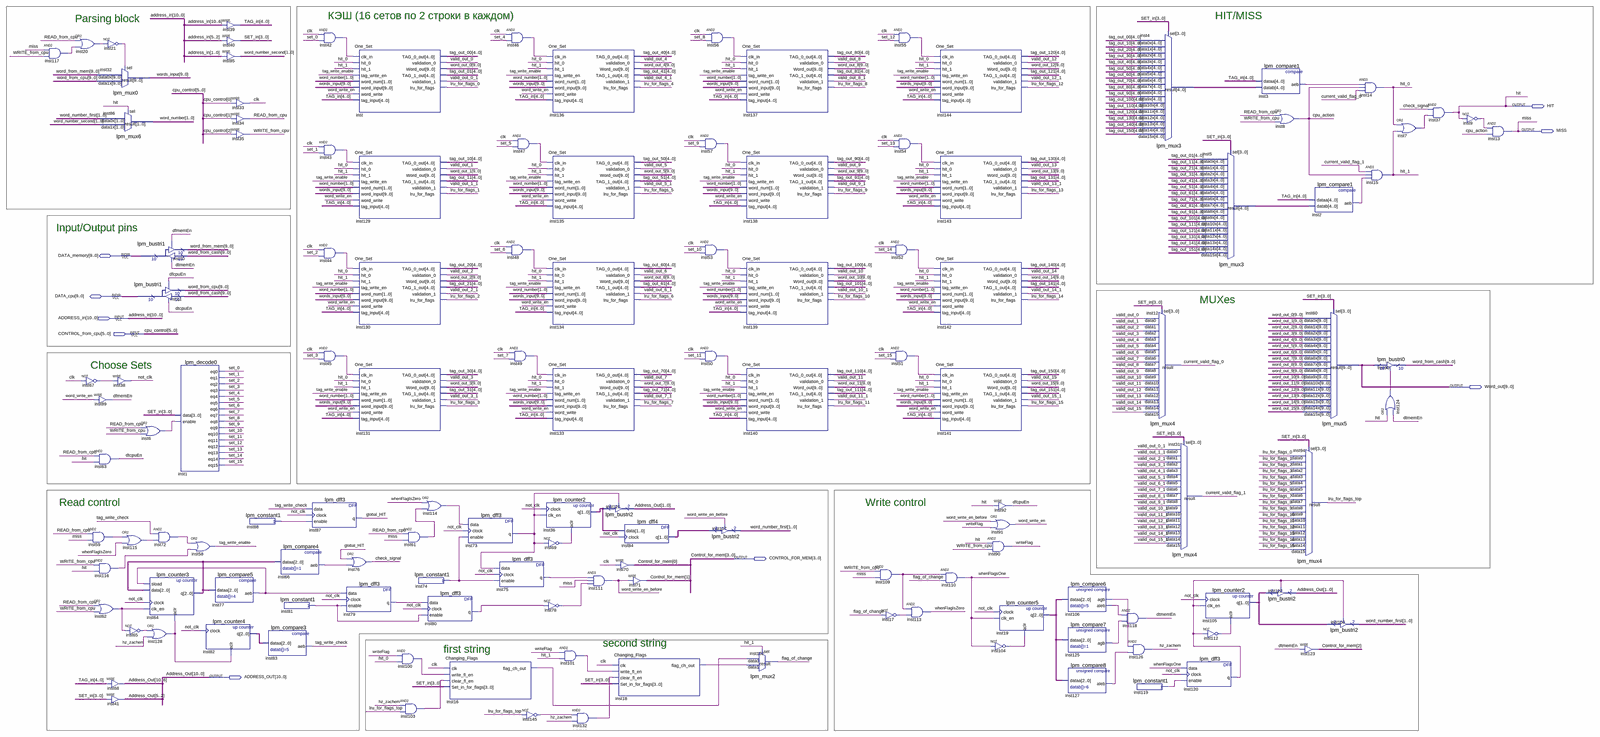
[diagram p0: schematic sheet, whole]
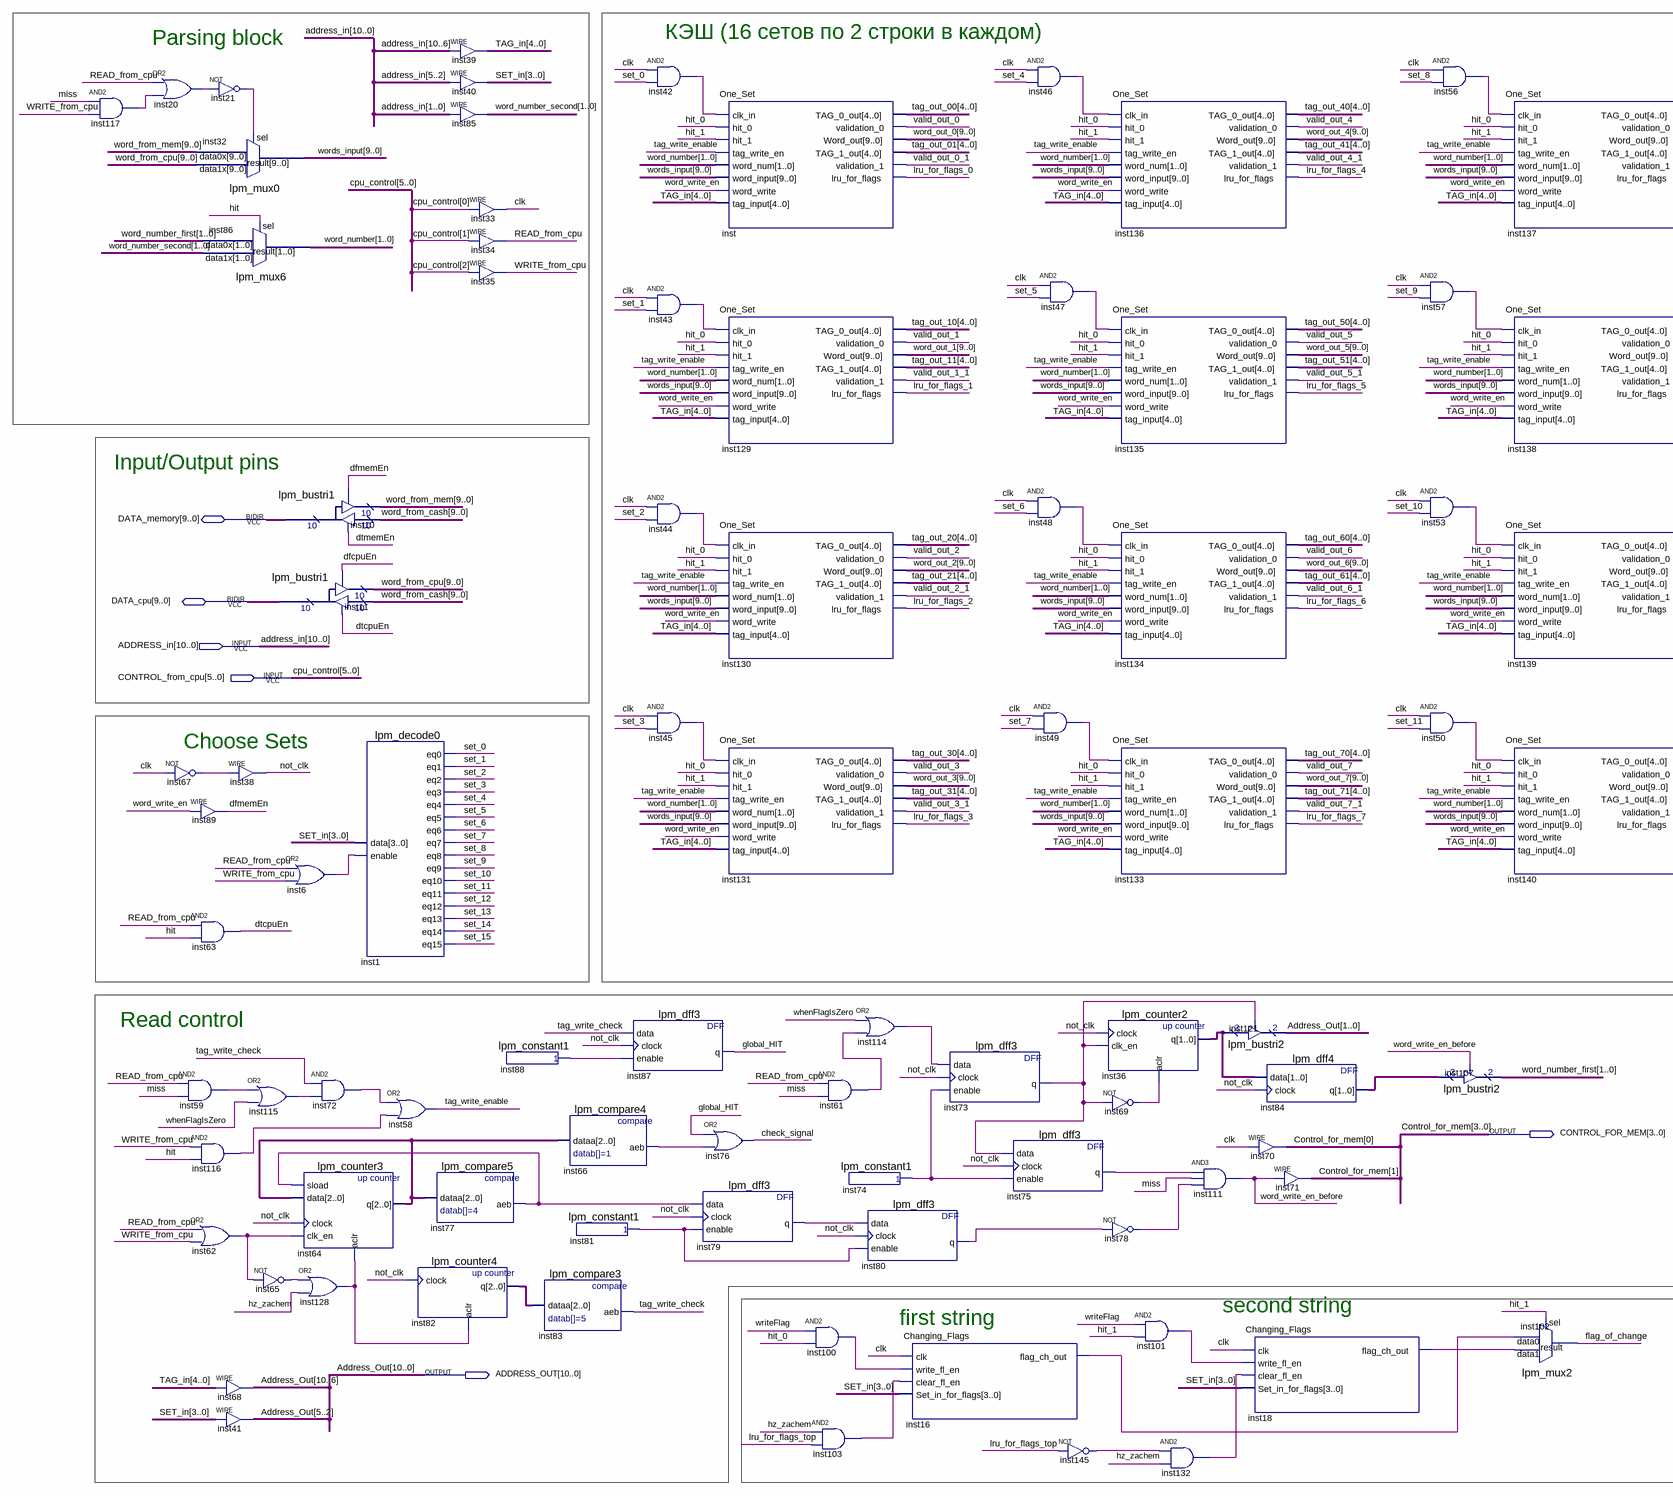
[diagram p1: schematic sheet, left part]
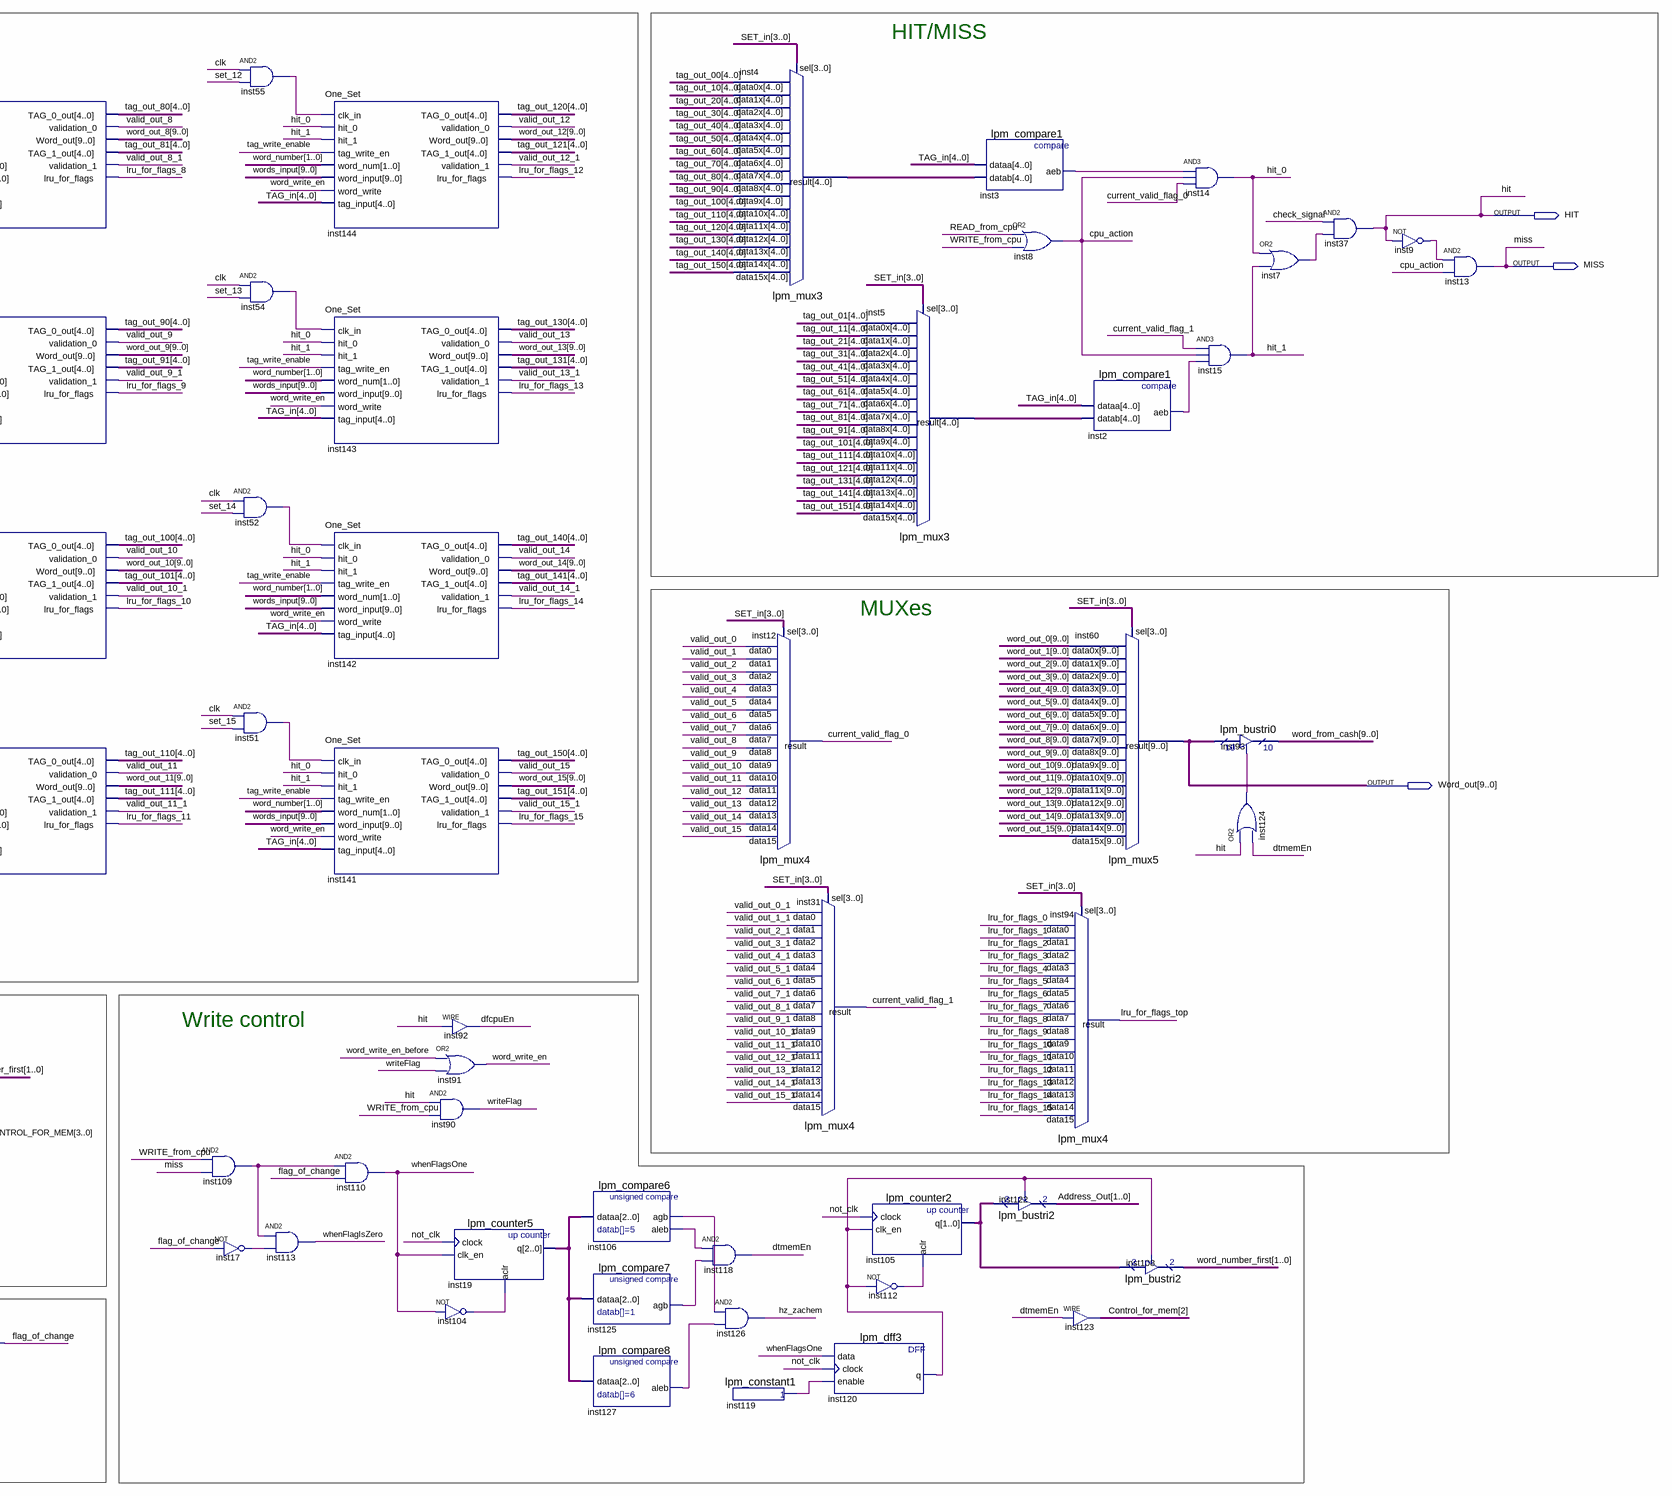
[diagram p2: schematic sheet, right part]
// Quartus schematic Cash.bdf as structural Verilog: 132 symbols, 9 pins
module Cash (
  input  [10:0] ADDRESS_in,
  input  [5:0] CONTROL_from_cpu,
  inout  [9:0] DATA_memory,
  inout  [9:0] DATA_cpu,
  output HIT,
  output MISS,
  output [9:0] Word_out,
  output [3:0] CONTROL_FOR_MEM,
  output [10:0] ADDRESS_OUT
);

  wire check_signal, clk, cpu_action, current_valid_flag_0, current_valid_flag_1, dfcpuEn, dfmemEn, dtcpuEn,
       dtmemEn, flag_of_change, global_HIT, hit_0, hit_1, hz_zachem, inst2_aeb, inst3_aeb, inst6_out,
       inst7_out, inst9_out, inst16_flag_ch_out, inst17_out, inst18_flag_ch_out, inst20_out, inst21_out,
       inst42_out, inst43_out, inst44_out, inst45_out, inst46_out, inst47_out, inst48_out, inst49_out,
       inst50_out, inst51_out, inst52_out, inst53_out, inst54_out, inst55_out, inst56_out, inst57_out,
       inst59_out, inst61_out, inst62_out, inst65_out, inst66_aeb, inst67_out, inst69_out, inst72_out,
       inst73_q, inst74_result, inst75_q, inst77_aeb, inst78_out, inst79_q, inst80_q, inst81_result,
       inst88_result, inst100_out, inst101_out, inst103_out, inst104_out, inst106_agb, inst106_aleb,
       inst109_out, inst112_out, inst114_out, inst115_out, inst116_out, inst117_out, inst119_result,
       inst120_q, inst124_out, inst125_agb, inst127_aleb, inst128_out, inst132_out, inst145_out,
       lru_for_flags_0, lru_for_flags_1, lru_for_flags_2, lru_for_flags_3, lru_for_flags_4, lru_for_flags_5,
       lru_for_flags_6, lru_for_flags_7, lru_for_flags_8, lru_for_flags_9, lru_for_flags_10,
       lru_for_flags_11, lru_for_flags_12, lru_for_flags_13, lru_for_flags_14, lru_for_flags_15,
       lru_for_flags_top, not_clk, READ_from_cpu, set_0, set_1, set_2, set_3, set_4, set_5, set_6, set_7,
       set_8, set_9, set_10, set_11, set_12, set_13, set_14, set_15, tag_write_check, tag_write_enable,
       valid_out_0, valid_out_0_1, valid_out_1, valid_out_1_1, valid_out_2, valid_out_2_1, valid_out_3,
       valid_out_3_1, valid_out_4, valid_out_4_1, valid_out_5, valid_out_5_1, valid_out_6, valid_out_6_1,
       valid_out_7, valid_out_7_1, valid_out_8, valid_out_8_1, valid_out_9, valid_out_9_1, valid_out_10,
       valid_out_10_1, valid_out_11, valid_out_11_1, valid_out_12, valid_out_12_1, valid_out_13,
       valid_out_13_1, valid_out_14, valid_out_14_1, valid_out_15, valid_out_15_1, whenFlagIsZero,
       whenFlagsOne, word_write_en, word_write_en_before, WRITE_from_cpu, writeFlag;
  wire [1:0] inst36_q, inst84_q, inst105_q, word_number, word_number_first, word_number_second;
  wire [2:0] inst19_q, inst64_q, inst82_q;
  wire [3:0] SET_in;
  wire [4:0] inst4_result, inst5_result, TAG_in, tag_out_00, tag_out_01, tag_out_10, tag_out_11, tag_out_20,
       tag_out_21, tag_out_30, tag_out_31, tag_out_40, tag_out_41, tag_out_50, tag_out_51, tag_out_60,
       tag_out_61, tag_out_70, tag_out_71, tag_out_80, tag_out_81, tag_out_90, tag_out_91, tag_out_100,
       tag_out_101, tag_out_110, tag_out_111, tag_out_120, tag_out_121, tag_out_130, tag_out_131,
       tag_out_140, tag_out_141, tag_out_150, tag_out_151;
  wire [9:0] word_from_cash, word_from_cpu, word_from_mem, word_out_0, word_out_1, word_out_2, word_out_3,
       word_out_4, word_out_5, word_out_6, word_out_7, word_out_8, word_out_9, word_out_10, word_out_11,
       word_out_12, word_out_13, word_out_14, word_out_15, words_input;

  and inst117 (inst117_out, MISS, WRITE_from_cpu);
  or inst20 (inst20_out, READ_from_cpu, inst117_out);
  not inst67 (inst67_out, clk);
  assign dfmemEn = word_write_en;  // WIRE inst89
  and inst63 (dtcpuEn, READ_from_cpu, HIT);
  and inst59 (inst59_out, READ_from_cpu, MISS);
  and inst116 (inst116_out, WRITE_from_cpu, HIT);
  or inst62 (inst62_out, READ_from_cpu, WRITE_from_cpu);
  not inst21 (inst21_out, inst20_out);
  lpm_mux0 inst32 (.data1x(word_from_cpu), .data0x(word_from_mem), .sel(inst21_out), .result(words_input));
  lpm_mux6 inst86 (.data1x(word_number_second), .data0x(word_number_first), .sel(HIT), .result(word_number));
  assign not_clk = inst67_out;  // WIRE inst38
  assign ADDRESS_OUT[10:6] = TAG_in;  // WIRE inst68
  assign ADDRESS_OUT[5:2] = SET_in;  // WIRE inst41
  lpm_bustri1 inst10 (
    .enabledt(dtmemEn), .data(word_from_cash), .enabletr(dfmemEn), .result(word_from_mem),
    .tridata(DATA_memory));
  lpm_bustri1 inst11 (
    .enabledt(dtcpuEn), .data(word_from_cash), .enabletr(dfcpuEn), .result(word_from_cpu), .tridata(DATA_cpu));
  or inst6 (inst6_out, READ_from_cpu, WRITE_from_cpu);
  or inst115 (inst115_out, inst59_out, whenFlagIsZero);
  lpm_counter3 inst64 (
    .sload(inst77_aeb), .data(inst64_q), .clock(not_clk), .clk_en(inst62_out), .aclr(inst128_out),
    .q(inst64_q));
  not inst65 (inst65_out, inst62_out);
  and inst72 (inst72_out, tag_write_check, inst115_out);
  or inst128 (inst128_out, inst65_out, hz_zachem);
  lpm_decode0 inst1 (
    .data(SET_in), .enable(inst6_out), .eq0(set_0), .eq1(set_1), .eq2(set_2), .eq3(set_3), .eq4(set_4),
    .eq5(set_5), .eq6(set_6), .eq7(set_7), .eq8(set_8), .eq9(set_9), .eq10(set_10), .eq11(set_11),
    .eq12(set_12), .eq13(set_13), .eq14(set_14), .eq15(set_15));
  or inst58 (tag_write_enable, inst72_out, inst116_out);
  lpm_compare5 inst77 (.dataa(inst64_q), .aeb(inst77_aeb));
  lpm_counter4 inst82 (.clock(not_clk), .aclr(inst128_out), .q(inst82_q));
  assign TAG_in = ADDRESS_in[10:6];  // WIRE inst39
  assign SET_in = ADDRESS_in[5:2];  // WIRE inst40
  assign word_number_second = ADDRESS_in[1:0];  // WIRE inst85
  assign clk = CONTROL_from_cpu[0];  // WIRE inst33
  assign READ_from_cpu = CONTROL_from_cpu[1];  // WIRE inst34
  assign WRITE_from_cpu = CONTROL_from_cpu[2];  // WIRE inst35
  lpm_constant1 inst88 (.result(inst88_result));
  lpm_compare3 inst83 (.dataa(inst82_q), .aeb(tag_write_check));
  lpm_compare4 inst66 (.dataa(inst64_q), .aeb(inst66_aeb));
  lpm_constant1 inst81 (.result(inst81_result));
  and inst42 (inst42_out, clk, set_0);
  and inst43 (inst43_out, clk, set_1);
  and inst44 (inst44_out, clk, set_2);
  and inst45 (inst45_out, clk, set_3);
  lpm_dff3 inst87 (.data(tag_write_check), .clock(not_clk), .enable(inst88_result), .q(global_HIT));
  lpm_dff3 inst79 (.data(inst77_aeb), .clock(not_clk), .enable(inst81_result), .q(inst79_q));
  One_Set inst (
    .clk_in(inst42_out), .hit_0(hit_0), .hit_1(hit_1), .tag_write_en(tag_write_enable),
    .word_num(word_number), .word_input(words_input), .word_write(word_write_en), .tag_input(TAG_in),
    .TAG_0_out(tag_out_00), .validation_0(valid_out_0), .Word_out(word_out_0), .TAG_1_out(tag_out_01),
    .validation_1(valid_out_0_1), .lru_for_flags(lru_for_flags_0));
  One_Set inst129 (
    .clk_in(inst43_out), .hit_0(hit_0), .hit_1(hit_1), .tag_write_en(tag_write_enable),
    .word_num(word_number), .word_input(words_input), .word_write(word_write_en), .tag_input(TAG_in),
    .TAG_0_out(tag_out_10), .validation_0(valid_out_1), .Word_out(word_out_1), .TAG_1_out(tag_out_11),
    .validation_1(valid_out_1_1), .lru_for_flags(lru_for_flags_1));
  One_Set inst130 (
    .clk_in(inst44_out), .hit_0(hit_0), .hit_1(hit_1), .tag_write_en(tag_write_enable),
    .word_num(word_number), .word_input(words_input), .word_write(word_write_en), .tag_input(TAG_in),
    .TAG_0_out(tag_out_20), .validation_0(valid_out_2), .Word_out(word_out_2), .TAG_1_out(tag_out_21),
    .validation_1(valid_out_2_1), .lru_for_flags(lru_for_flags_2));
  One_Set inst131 (
    .clk_in(inst45_out), .hit_0(hit_0), .hit_1(hit_1), .tag_write_en(tag_write_enable),
    .word_num(word_number), .word_input(words_input), .word_write(word_write_en), .tag_input(TAG_in),
    .TAG_0_out(tag_out_30), .validation_0(valid_out_3), .Word_out(word_out_3), .TAG_1_out(tag_out_31),
    .validation_1(valid_out_3_1), .lru_for_flags(lru_for_flags_3));
  or inst76 (check_signal, global_HIT, inst66_aeb);
  and inst61 (inst61_out, READ_from_cpu, MISS);
  lpm_constant1 inst74 (.result(inst74_result));
  and inst100 (inst100_out, writeFlag, hit_0);
  and inst103 (inst103_out, hz_zachem, lru_for_flags_top);
  or inst114 (inst114_out, whenFlagIsZero, inst61_out);
  lpm_dff3 inst80 (.data(inst79_q), .clock(not_clk), .enable(inst81_result), .q(inst80_q));
  Changing_Flags inst16 (
    .clk(clk), .write_fl_en(inst100_out), .clear_fl_en(inst103_out), .Set_in_for_flags(SET_in),
    .flag_ch_out(inst16_flag_ch_out));
  lpm_dff3 inst73 (.data(inst114_out), .clock(not_clk), .enable(inst74_result), .q(inst73_q));
  lpm_dff3 inst75 (.data(inst73_q), .clock(not_clk), .enable(inst74_result), .q(inst75_q));
  and inst46 (inst46_out, clk, set_4);
  and inst47 (inst47_out, clk, set_5);
  and inst48 (inst48_out, clk, set_6);
  and inst49 (inst49_out, clk, set_7);
  lpm_counter2 inst36 (.clock(not_clk), .clk_en(inst73_q), .aclr(inst69_out), .q(inst36_q));
  not inst69 (inst69_out, inst73_q);
  not inst78 (inst78_out, inst80_q);
  not inst145 (inst145_out, lru_for_flags_top);
  One_Set inst136 (
    .clk_in(inst46_out), .hit_0(hit_0), .hit_1(hit_1), .tag_write_en(tag_write_enable),
    .word_num(word_number), .word_input(words_input), .word_write(word_write_en), .tag_input(TAG_in),
    .TAG_0_out(tag_out_40), .validation_0(valid_out_4), .Word_out(word_out_4), .TAG_1_out(tag_out_41),
    .validation_1(valid_out_4_1), .lru_for_flags(lru_for_flags_4));
  One_Set inst135 (
    .clk_in(inst47_out), .hit_0(hit_0), .hit_1(hit_1), .tag_write_en(tag_write_enable),
    .word_num(word_number), .word_input(words_input), .word_write(word_write_en), .tag_input(TAG_in),
    .TAG_0_out(tag_out_50), .validation_0(valid_out_5), .Word_out(word_out_5), .TAG_1_out(tag_out_51),
    .validation_1(valid_out_5_1), .lru_for_flags(lru_for_flags_5));
  One_Set inst134 (
    .clk_in(inst48_out), .hit_0(hit_0), .hit_1(hit_1), .tag_write_en(tag_write_enable),
    .word_num(word_number), .word_input(words_input), .word_write(word_write_en), .tag_input(TAG_in),
    .TAG_0_out(tag_out_60), .validation_0(valid_out_6), .Word_out(word_out_6), .TAG_1_out(tag_out_61),
    .validation_1(valid_out_6_1), .lru_for_flags(lru_for_flags_6));
  One_Set inst133 (
    .clk_in(inst49_out), .hit_0(hit_0), .hit_1(hit_1), .tag_write_en(tag_write_enable),
    .word_num(word_number), .word_input(words_input), .word_write(word_write_en), .tag_input(TAG_in),
    .TAG_0_out(tag_out_70), .validation_0(valid_out_7), .Word_out(word_out_7), .TAG_1_out(tag_out_71),
    .validation_1(valid_out_7_1), .lru_for_flags(lru_for_flags_7));
  and inst101 (inst101_out, writeFlag, hit_1);
  and inst111 (word_write_en_before, inst75_q, MISS, inst78_out);
  and inst132 (inst132_out, inst145_out, hz_zachem);
  lpm_bustri2 inst121 (.enabledt(inst73_q), .data(inst36_q), .tridata(ADDRESS_OUT[1:0]));
  lpm_dff4 inst84 (.data(inst36_q), .clock(not_clk), .q(inst84_q));
  assign CONTROL_FOR_MEM[0] = clk;  // WIRE inst70
  Changing_Flags inst18 (
    .clk(clk), .write_fl_en(inst101_out), .clear_fl_en(inst132_out), .Set_in_for_flags(SET_in),
    .flag_ch_out(inst18_flag_ch_out));
  assign CONTROL_FOR_MEM[1] = word_write_en_before;  // WIRE inst71
  and inst56 (inst56_out, clk, set_8);
  and inst57 (inst57_out, clk, set_9);
  and inst53 (inst53_out, clk, set_10);
  and inst50 (inst50_out, clk, set_11);
  lpm_bustri2 inst107 (.enabledt(word_write_en_before), .data(inst84_q), .tridata(word_number_first));
  One_Set inst137 (
    .clk_in(inst56_out), .hit_0(hit_0), .hit_1(hit_1), .tag_write_en(tag_write_enable),
    .word_num(word_number), .word_input(words_input), .word_write(word_write_en), .tag_input(TAG_in),
    .TAG_0_out(tag_out_80), .validation_0(valid_out_8), .Word_out(word_out_8), .TAG_1_out(tag_out_81),
    .validation_1(valid_out_8_1), .lru_for_flags(lru_for_flags_8));
  One_Set inst138 (
    .clk_in(inst57_out), .hit_0(hit_0), .hit_1(hit_1), .tag_write_en(tag_write_enable),
    .word_num(word_number), .word_input(words_input), .word_write(word_write_en), .tag_input(TAG_in),
    .TAG_0_out(tag_out_90), .validation_0(valid_out_9), .Word_out(word_out_9), .TAG_1_out(tag_out_91),
    .validation_1(valid_out_9_1), .lru_for_flags(lru_for_flags_9));
  One_Set inst139 (
    .clk_in(inst53_out), .hit_0(hit_0), .hit_1(hit_1), .tag_write_en(tag_write_enable),
    .word_num(word_number), .word_input(words_input), .word_write(word_write_en), .tag_input(TAG_in),
    .TAG_0_out(tag_out_100), .validation_0(valid_out_10), .Word_out(word_out_10), .TAG_1_out(tag_out_101),
    .validation_1(valid_out_10_1), .lru_for_flags(lru_for_flags_10));
  One_Set inst140 (
    .clk_in(inst50_out), .hit_0(hit_0), .hit_1(hit_1), .tag_write_en(tag_write_enable),
    .word_num(word_number), .word_input(words_input), .word_write(word_write_en), .tag_input(TAG_in),
    .TAG_0_out(tag_out_110), .validation_0(valid_out_11), .Word_out(word_out_11), .TAG_1_out(tag_out_111),
    .validation_1(valid_out_11_1), .lru_for_flags(lru_for_flags_11));
  lpm_mux2 inst102 (.data1(inst18_flag_ch_out), .data0(inst16_flag_ch_out), .sel(hit_1), .result(flag_of_change));
  and inst55 (inst55_out, clk, set_12);
  and inst54 (inst54_out, clk, set_13);
  and inst52 (inst52_out, clk, set_14);
  and inst51 (inst51_out, clk, set_15);
  and inst109 (inst109_out, WRITE_from_cpu, MISS);
  not inst17 (inst17_out, flag_of_change);
  and inst113 (whenFlagIsZero, inst109_out, inst17_out);
  One_Set inst144 (
    .clk_in(inst55_out), .hit_0(hit_0), .hit_1(hit_1), .tag_write_en(tag_write_enable),
    .word_num(word_number), .word_input(words_input), .word_write(word_write_en), .tag_input(TAG_in),
    .TAG_0_out(tag_out_120), .validation_0(valid_out_12), .Word_out(word_out_12), .TAG_1_out(tag_out_121),
    .validation_1(valid_out_12_1), .lru_for_flags(lru_for_flags_12));
  One_Set inst143 (
    .clk_in(inst54_out), .hit_0(hit_0), .hit_1(hit_1), .tag_write_en(tag_write_enable),
    .word_num(word_number), .word_input(words_input), .word_write(word_write_en), .tag_input(TAG_in),
    .TAG_0_out(tag_out_130), .validation_0(valid_out_13), .Word_out(word_out_13), .TAG_1_out(tag_out_131),
    .validation_1(valid_out_13_1), .lru_for_flags(lru_for_flags_13));
  One_Set inst142 (
    .clk_in(inst52_out), .hit_0(hit_0), .hit_1(hit_1), .tag_write_en(tag_write_enable),
    .word_num(word_number), .word_input(words_input), .word_write(word_write_en), .tag_input(TAG_in),
    .TAG_0_out(tag_out_140), .validation_0(valid_out_14), .Word_out(word_out_14), .TAG_1_out(tag_out_141),
    .validation_1(valid_out_14_1), .lru_for_flags(lru_for_flags_14));
  One_Set inst141 (
    .clk_in(inst51_out), .hit_0(hit_0), .hit_1(hit_1), .tag_write_en(tag_write_enable),
    .word_num(word_number), .word_input(words_input), .word_write(word_write_en), .tag_input(TAG_in),
    .TAG_0_out(tag_out_150), .validation_0(valid_out_15), .Word_out(word_out_15), .TAG_1_out(tag_out_151),
    .validation_1(valid_out_15_1), .lru_for_flags(lru_for_flags_15));
  and inst110 (whenFlagsOne, inst109_out, flag_of_change);
  assign dfcpuEn = HIT;  // WIRE inst92
  or inst91 (word_write_en, word_write_en_before, writeFlag);
  and inst90 (writeFlag, HIT, WRITE_from_cpu);
  lpm_counter5 inst19 (.clock(not_clk), .clk_en(whenFlagsOne), .aclr(inst104_out), .q(inst19_q));
  not inst104 (inst104_out, whenFlagsOne);
  lpm_compare6 inst106 (.dataa(inst19_q), .agb(inst106_agb), .aleb(inst106_aleb));
  lpm_compare7 inst125 (.dataa(inst19_q), .agb(inst125_agb));
  lpm_compare8 inst127 (.dataa(inst19_q), .aleb(inst127_aleb));
  lpm_mux3 inst4 (
    .data15x(tag_out_150), .data14x(tag_out_140), .data13x(tag_out_130), .data12x(tag_out_120),
    .data11x(tag_out_110), .data10x(tag_out_100), .data9x(tag_out_90), .data8x(tag_out_80),
    .data7x(tag_out_70), .data6x(tag_out_60), .data5x(tag_out_50), .data4x(tag_out_40), .data3x(tag_out_30),
    .data2x(tag_out_20), .data1x(tag_out_10), .data0x(tag_out_00), .sel(SET_in), .result(inst4_result));
  lpm_mux4 inst12 (
    .data15(valid_out_15), .data14(valid_out_14), .data13(valid_out_13), .data12(valid_out_12),
    .data11(valid_out_11), .data10(valid_out_10), .data9(valid_out_9), .data8(valid_out_8),
    .data7(valid_out_7), .data6(valid_out_6), .data5(valid_out_5), .data4(valid_out_4), .data3(valid_out_3),
    .data2(valid_out_2), .data1(valid_out_1), .data0(valid_out_0), .sel(SET_in), .result(current_valid_flag_0));
  and inst118 (dtmemEn, inst106_aleb, inst125_agb);
  and inst126 (hz_zachem, inst106_agb, inst127_aleb);
  lpm_constant1 inst119 (.result(inst119_result));
  lpm_mux4 inst31 (
    .data15(valid_out_15_1), .data14(valid_out_14_1), .data13(valid_out_13_1), .data12(valid_out_12_1),
    .data11(valid_out_11_1), .data10(valid_out_10_1), .data9(valid_out_9_1), .data8(valid_out_8_1),
    .data7(valid_out_7_1), .data6(valid_out_6_1), .data5(valid_out_5_1), .data4(valid_out_4_1),
    .data3(valid_out_3_1), .data2(valid_out_2_1), .data1(valid_out_1_1), .data0(valid_out_0_1), .sel(SET_in),
    .result(current_valid_flag_1));
  lpm_dff3 inst120 (.data(whenFlagsOne), .clock(not_clk), .enable(inst119_result), .q(inst120_q));
  lpm_mux3 inst5 (
    .data15x(tag_out_151), .data14x(tag_out_141), .data13x(tag_out_131), .data12x(tag_out_121),
    .data11x(tag_out_111), .data10x(tag_out_101), .data9x(tag_out_91), .data8x(tag_out_81),
    .data7x(tag_out_71), .data6x(tag_out_61), .data5x(tag_out_51), .data4x(tag_out_41), .data3x(tag_out_31),
    .data2x(tag_out_21), .data1x(tag_out_11), .data0x(tag_out_01), .sel(SET_in), .result(inst5_result));
  lpm_counter2 inst105 (.clock(not_clk), .clk_en(inst120_q), .aclr(inst112_out), .q(inst105_q));
  not inst112 (inst112_out, inst120_q);
  lpm_compare1 inst3 (.dataa(TAG_in), .datab(inst4_result), .aeb(inst3_aeb));
  lpm_bustri2 inst122 (.enabledt(inst120_q), .data(inst105_q), .tridata(ADDRESS_OUT[1:0]));
  or inst8 (cpu_action, READ_from_cpu, WRITE_from_cpu);
  lpm_mux4 inst94 (
    .data15(lru_for_flags_15), .data14(lru_for_flags_14), .data13(lru_for_flags_13),
    .data12(lru_for_flags_12), .data11(lru_for_flags_11), .data10(lru_for_flags_10), .data9(lru_for_flags_9),
    .data8(lru_for_flags_8), .data7(lru_for_flags_7), .data6(lru_for_flags_6), .data5(lru_for_flags_5),
    .data4(lru_for_flags_4), .data3(lru_for_flags_3), .data2(lru_for_flags_2), .data1(lru_for_flags_1),
    .data0(lru_for_flags_0), .sel(SET_in), .result(lru_for_flags_top));
  lpm_compare1 inst2 (.dataa(TAG_in), .datab(inst5_result), .aeb(inst2_aeb));
  lpm_mux5 inst60 (
    .data15x(word_out_15), .data14x(word_out_14), .data13x(word_out_13), .data12x(word_out_12),
    .data11x(word_out_11), .data10x(word_out_10), .data9x(word_out_9), .data8x(word_out_8),
    .data7x(word_out_7), .data6x(word_out_6), .data5x(word_out_5), .data4x(word_out_4), .data3x(word_out_3),
    .data2x(word_out_2), .data1x(word_out_1), .data0x(word_out_0), .sel(SET_in), .result(Word_out));
  assign CONTROL_FOR_MEM[2] = dtmemEn;  // WIRE inst123
  lpm_bustri2 inst108 (.enabledt(inst120_q), .data(inst105_q), .tridata(word_number_first));
  and inst14 (hit_0, inst3_aeb, cpu_action, current_valid_flag_0);
  and inst15 (hit_1, current_valid_flag_1, cpu_action, inst2_aeb);
  lpm_bustri0 inst93 (.enabledt(inst124_out), .data(Word_out), .tridata(word_from_cash));
  or inst124 (inst124_out, HIT, dtmemEn);
  or inst7 (inst7_out, hit_0, hit_1);
  and inst37 (HIT, check_signal, inst7_out);
  not inst9 (inst9_out, HIT);
  and inst13 (MISS, inst9_out, cpu_action);

  // Other names for the same wires on the sheet: cpu_control[5:0] = CONTROL_from_cpu

  // Notes on the sheet:
  //   КЭШ (16 сетов по 2 строки в каждом)
  //   HIT/MISS
  //   Parsing block
  //   Input/Output pins
  //   MUXes
  //   Choose Sets
  //   Read control
  //   Write control
  //   second string
  //   first string
endmodule
